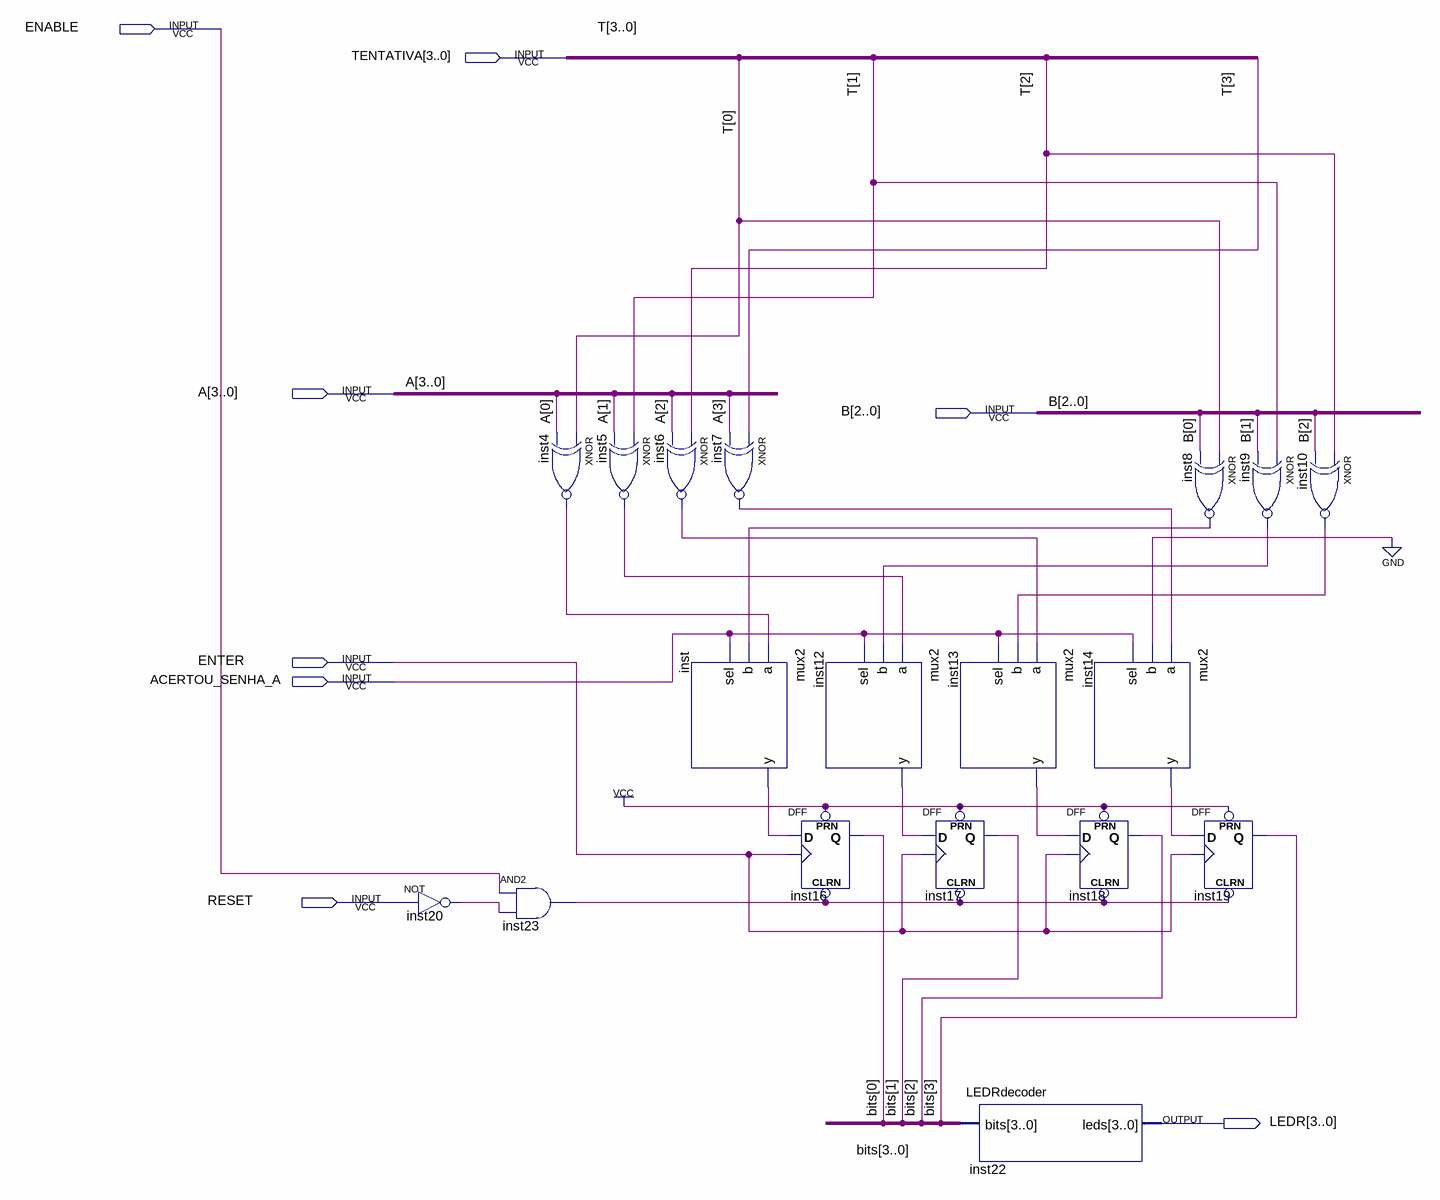
[diagram p0: schematic sheet]
// Quartus schematic DicaBitsCorretos.bdf as structural Verilog: 18 symbols, 8 pins
module DicaBitsCorretos (
  input  ENABLE,
  input  [3:0] TENTATIVA,
  input  [3:0] A,
  input  [2:0] B,
  input  ENTER,
  input  ACERTOU_SENHA_A,
  input  RESET,
  output [3:0] LEDR
);

  wire inst4_out, inst5_out, inst6_out, inst7_out, inst8_out, inst9_out, inst10_out, inst12_y, inst13_y,
       inst14_y, inst20_out, inst23_out, inst_y;
  wire [3:0] bits;

  not inst20 (inst20_out, RESET);
  and inst23 (inst23_out, ENABLE, inst20_out);
  xnor inst4 (inst4_out, TENTATIVA[0], A[0]);
  xnor inst5 (inst5_out, TENTATIVA[1], A[1]);
  xnor inst6 (inst6_out, TENTATIVA[2], A[2]);
  mux2 inst (.a(inst4_out), .b(inst8_out), .sel(ACERTOU_SENHA_A), .y(inst_y));
  xnor inst7 (inst7_out, TENTATIVA[3], A[3]);
  mux2 inst12 (.a(inst5_out), .b(inst9_out), .sel(ACERTOU_SENHA_A), .y(inst12_y));
  DFF inst16 (.CLRN(inst23_out), .CLK(ENTER), .D(inst_y), .PRN(1'b1), .Q(bits[0]));
  mux2 inst13 (.a(inst6_out), .b(inst10_out), .sel(ACERTOU_SENHA_A), .y(inst13_y));
  DFF inst17 (.CLRN(inst23_out), .CLK(ENTER), .D(inst12_y), .PRN(1'b1), .Q(bits[1]));
  LEDRdecoder inst22 (.bits(bits), .leds(LEDR));
  DFF inst18 (.CLRN(inst23_out), .CLK(ENTER), .D(inst13_y), .PRN(1'b1), .Q(bits[2]));
  mux2 inst14 (.a(inst7_out), .b(1'b0), .sel(ACERTOU_SENHA_A), .y(inst14_y));
  xnor inst8 (inst8_out, TENTATIVA[0], B[0]);
  DFF inst19 (.CLRN(inst23_out), .CLK(ENTER), .D(inst14_y), .PRN(1'b1), .Q(bits[3]));
  xnor inst9 (inst9_out, TENTATIVA[1], B[1]);
  xnor inst10 (inst10_out, TENTATIVA[2], B[2]);

  // Other names for the same wires on the sheet: T[3:0] = TENTATIVA
endmodule
